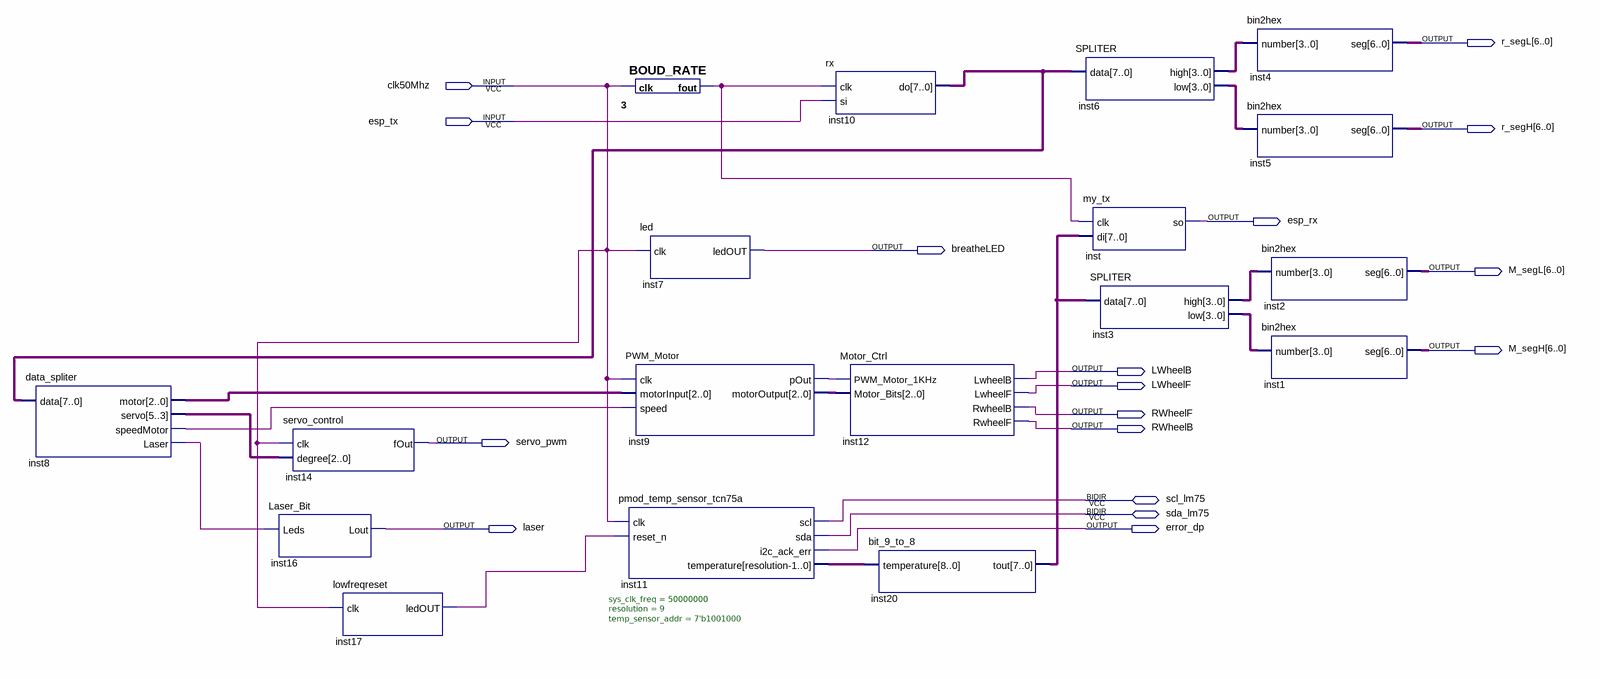
[diagram p0: schematic sheet]
// Quartus schematic Altera_Tutorial_Schematic.bdf as structural Verilog: 18 symbols, 17 pins
module Altera_Tutorial_Schematic (
  input  clk50Mhz,
  input  esp_tx,
  inout  scl_lm75,
  inout  sda_lm75,
  output [6:0] r_segL,
  output [6:0] r_segH,
  output esp_rx,
  output breatheLED,
  output [6:0] M_segL,
  output [6:0] M_segH,
  output LWheelB,
  output LWheelF,
  output RWheelF,
  output RWheelB,
  output servo_pwm,
  output laser,
  output error_dp
);

  wire inst8_laser, inst8_speedmotor, inst9_pout, inst17_ledout, n3_fout;
  wire [2:0] inst8_motor, inst8_servo, inst9_motoroutput;
  wire [3:0] inst3_high, inst3_low, inst6_high, inst6_low;
  wire [7:0] inst10_do, inst20_tout;
  wire [8:0] inst11_temperature;

  data_spliter inst8 (
    .data(inst10_do), .motor(inst8_motor), .servo(inst8_servo), .speedMotor(inst8_speedmotor),
    .Laser(inst8_laser));
  servo_control inst14 (.clk(clk50Mhz), .degree(inst8_servo), .fOut(servo_pwm));
  Laser_Bit inst16 (.Leds(inst8_laser), .Lout(laser));
  lowfreqreset inst17 (.clk(clk50Mhz), .ledOUT(inst17_ledout));
  BOUD_RATE u_3 (.clk(clk50Mhz), .fout(n3_fout));
  led inst7 (.clk(clk50Mhz), .ledOUT(breatheLED));
  PWM_Motor inst9 (
    .clk(clk50Mhz), .motorInput(inst8_motor), .speed(inst8_speedmotor), .pOut(inst9_pout),
    .motorOutput(inst9_motoroutput));
  pmod_temp_sensor_tcn75a #(.sys_clk_freq(50000000), .resolution(9), .temp_sensor_addr(7'b1001000)) inst11 (
    .clk(clk50Mhz), .reset_n(inst17_ledout), .i2c_ack_err(error_dp), .temperature(inst11_temperature),
    .scl(scl_lm75), .sda(sda_lm75));
  rx inst10 (.clk(n3_fout), .si(esp_tx), .\do (inst10_do));
  Motor_Ctrl inst12 (
    .PWM_Motor_1KHz(inst9_pout), .Motor_Bits(inst9_motoroutput), .LwheelB(LWheelB), .LwheelF(LWheelF),
    .RwheelB(RWheelF), .RwheelF(RWheelB));
  bit_9_to_8 inst20 (.temperature(inst11_temperature), .tout(inst20_tout));
  SPLITER inst6 (.data(inst10_do), .high(inst6_high), .low(inst6_low));
  my_tx inst (.clk(n3_fout), .di(inst20_tout), .so(esp_rx));
  SPLITER inst3 (.data(inst20_tout), .high(inst3_high), .low(inst3_low));
  bin2hex inst4 (.number(inst6_high), .seg(r_segL));
  bin2hex inst5 (.number(inst6_low), .seg(r_segH));
  bin2hex inst2 (.number(inst3_high), .seg(M_segL));
  bin2hex inst1 (.number(inst3_low), .seg(M_segH));
endmodule
